# EasyEDA Pro project ProDoc_PCB3_2025-07-30.epro

# Board PCB3
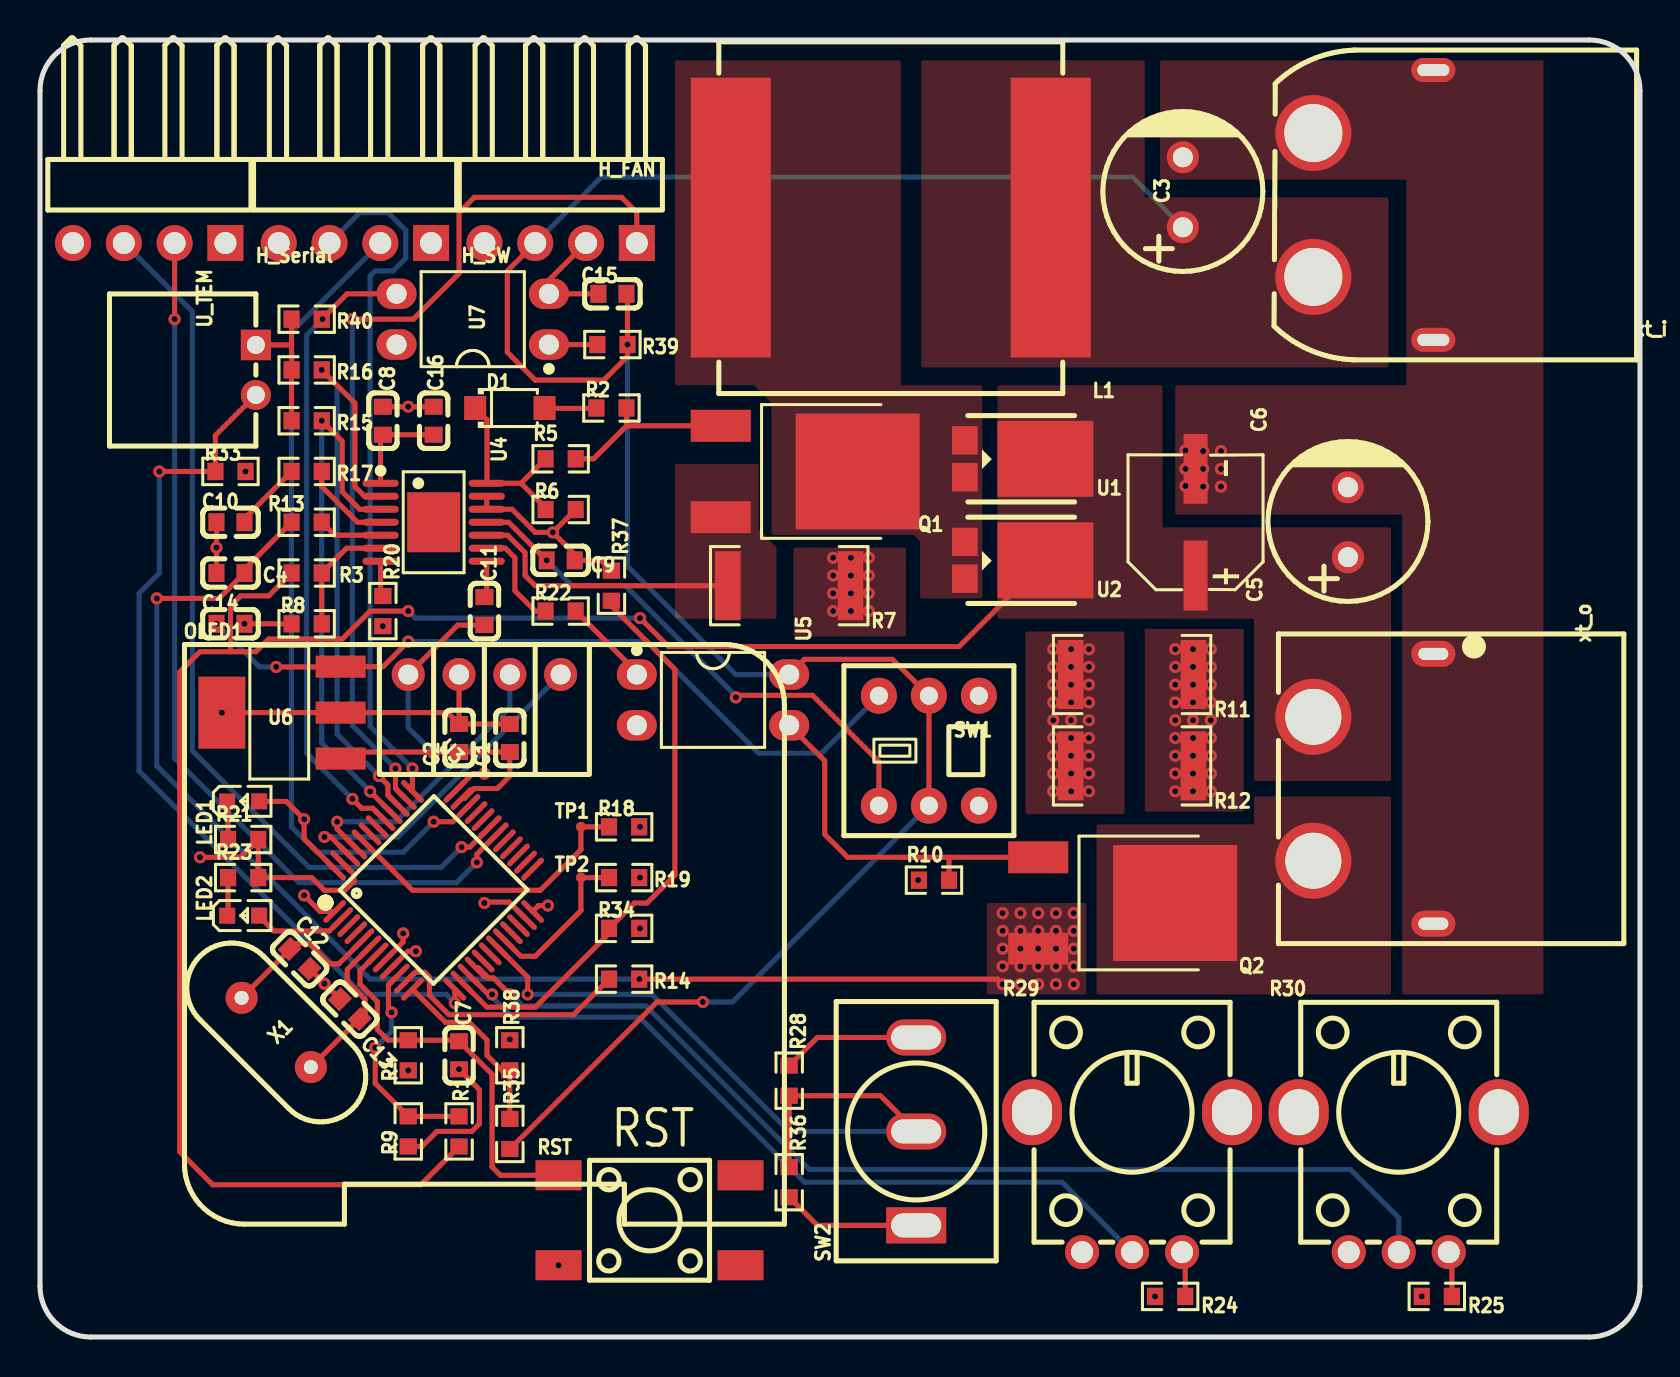
[diagram p0: board, top side]
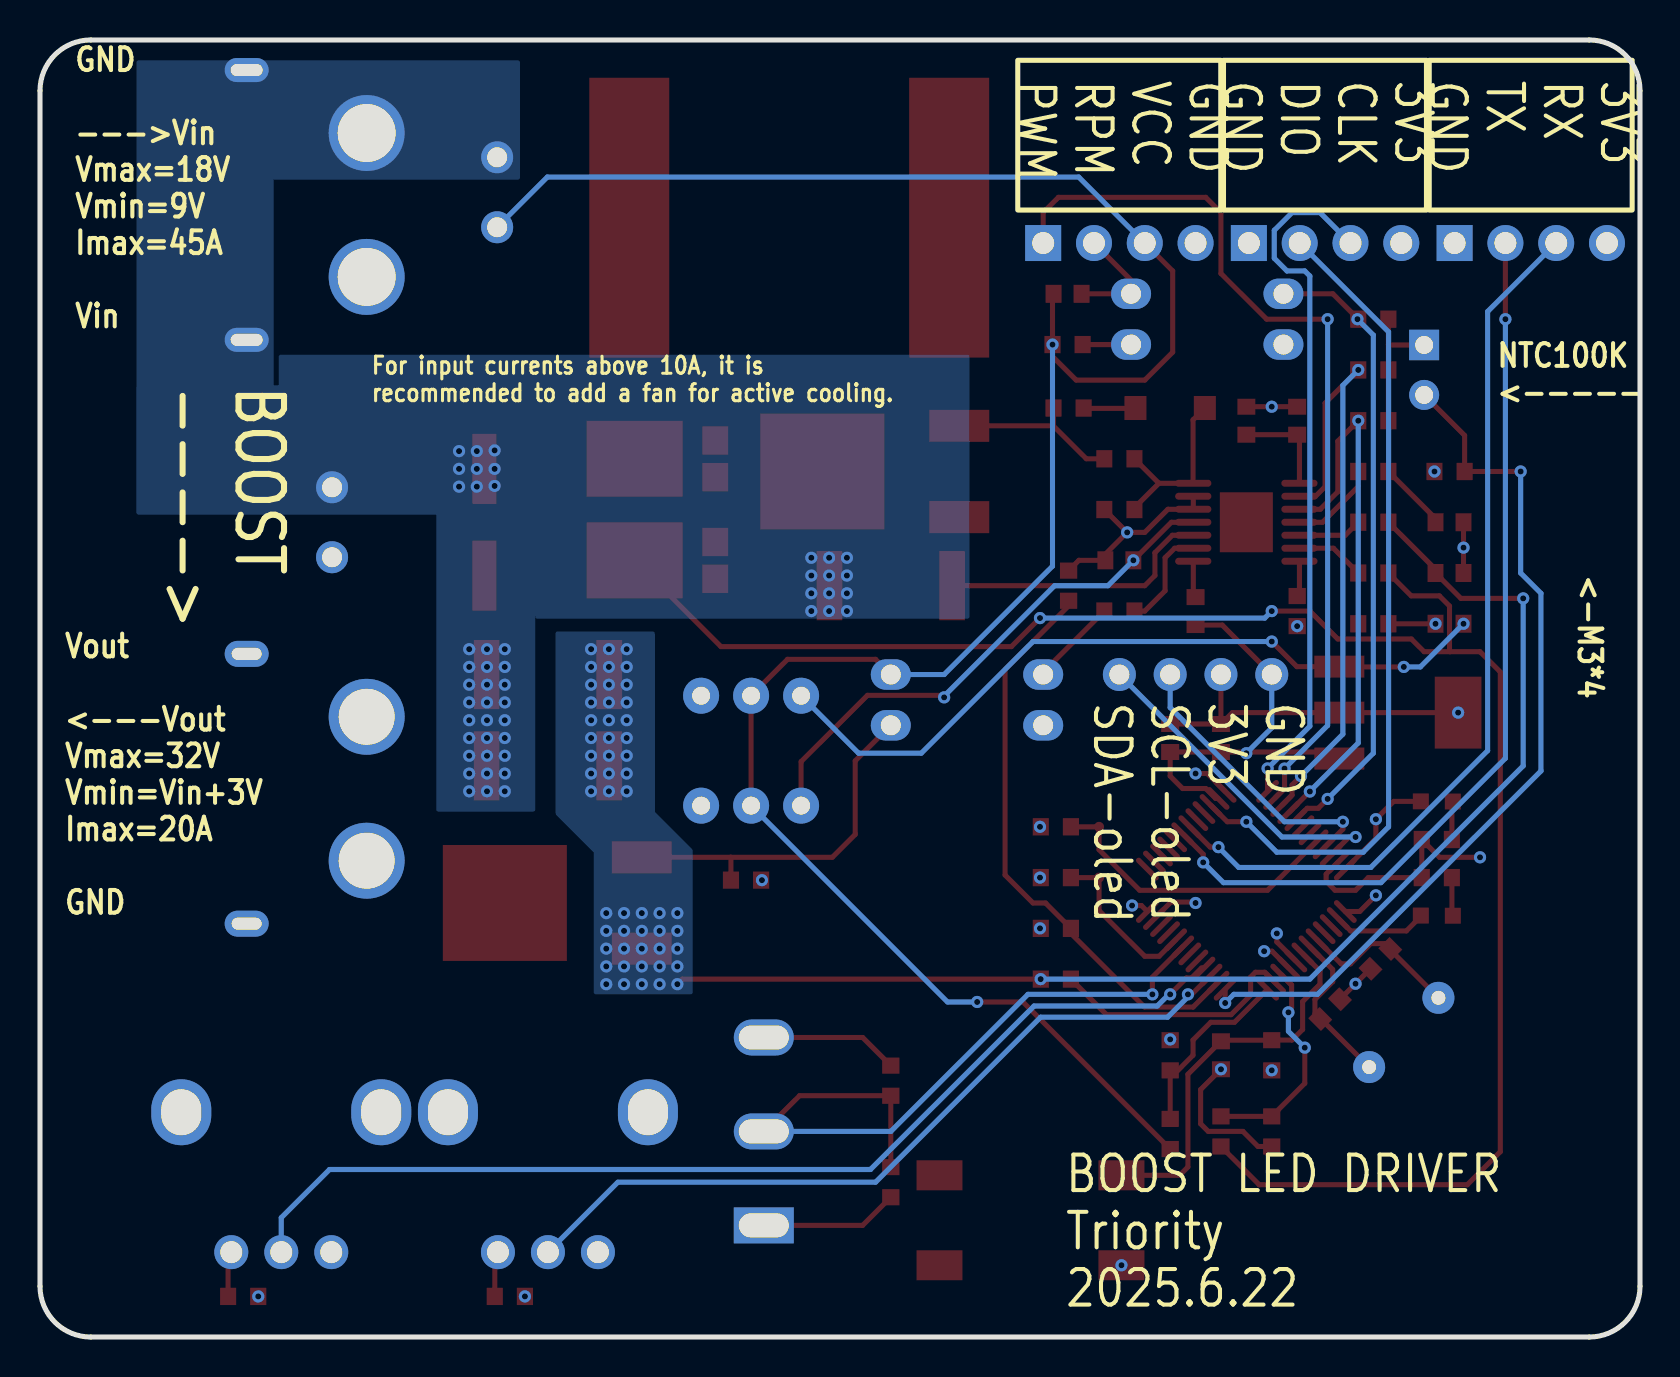
[diagram p1: board, bottom side, seen from below]

Outline 80.01 x 64.9 mm; copper layers: Top Layer, Inner1, Inner2, Bottom Layer. Coordinates in mm from the lower left corner of the outline.
Outline path: 0,62.36 0,2.54 arc(0.74,0.74) 2.54,0 77.47,0 arc(79.27,0.74) 80.01,2.54 80.01,62.36 arc(79.27,64.15) 77.47,64.9 2.54,64.9 arc(0.74,64.15) 0,62.36
Stack: Top Layer 0.035mm 外层铜厚1oz / Dielectric1 0.2104mm 7628 RC49% 8.6mil / Inner1 0.0152mm 内层铜厚 / Dielectric2 1.065mm 1.1mm H/HOZ Copper / Inner2 0.0152mm 内层铜厚 / Dielectric3 0.2104mm 7628 RC49% 8.6mil / Bottom Layer 0.035mm 外层铜厚1oz

## Design rules (mm)
template: 自定义配置
spacing copperThickness1oz (default): track to track 0.102, other pairs 0.152 to 0.3
spacing copperThickness2oz: track to track 0.203, other pairs 0.152 to 0.3
track width copperThickness1oz (default): min 0.127, default 0.254, max 2.54
track width copperThickness2oz: min 0.203, default 0.254, max 2.54
differential pair differentialPair (default): width min 0.127, default 0.254, max 2.54; gap min 0.152, default 0.152
via viaSize (default): diameter min 0.5, default 0.61, max 10; hole min 0.3, default 0.305, max 6.3
net GND uses copperRegion1
net $1N5540 uses copperRegion1
net $1N5178 uses copperRegion1
net $1N4854 uses copperRegion1
net CS uses copperRegion1
net $1N5417 uses copperRegion1
pour e84 uses copperRegion1
pour e1380 uses copperRegion
pour e1620 uses copperRegion
pour e759 uses copperRegion

## Placement (name value [footprint] x y rotation side)
C1  10uF  [C0603]  23.5 29.97 90 top
C2  100nF  [C0603]  20.96 29.97 90 top
C3  100uF  [CAP-TH_BD8.0-P3.50-D0.6-FD]  57.15 57.28 90 top
C4  100nF  [C0603]  9.53 38.23 180 top
C5  100uF  [CAP-TH_BD8.0-P3.50-D0.6-FD]  65.41 40.77 90 top
C6  22uF  [CAP-SMD_BD6.3-L6.6-W6.6-LS7.2-R-RD-1]  57.78 40.77 270 top
C7  100nF  [C0603]  20.96 14.1 270 top
C8  1uf/10nf?  [C0603]  17.14 45.85 270 top
C9  100nF  [C0603]  26.03 38.86 180 top
C10  1nF  [C0603]  9.53 40.77 0 top
C11  100nF  [C0603]  22.22 36.32 270 top
C12  20pF  [C0603]  12.98 18.92 315 top
C13  20pF  [C0603]  15.5 16.41 135 top
C14  10uF  [C0603]  9.53 35.69 0 top
C15  100nF  [C0603]  28.62 52.2 0 top
C16  1uf/10nf?  [C0603]  19.69 45.85 270 top
D1  1N4148W  [SOD-123_L2.7-W1.6-LS3.8-RD]  23.5 46.48 0 top
H_FAN  PZ254R-11-04P  [HDR-TH_4P-P2.54-H-M-W10.4]  26.03 54.74 180 top
H_Serial  PZ254R-11-04P  [HDR-TH_4P-P2.54-H-M-W10.4]  5.46 54.74 180 top
H_SW  PZ254R-11-04P  [HDR-TH_4P-P2.54-H-M-W10.4]  15.75 54.74 180 top
L1  3.3uH  [IND-SMD_L17.5-W17.2]  42.55 56.01 180 top
LED1  NCD0603R1  [LED0603-RD_RED]  10.16 26.8 0 top
LED2  NCD0603R1  [LED0603-RD_RED]  10.16 21.08 0 top
OLED1  -  [0.96OLED_4P]  22.22 33.15 0 top
Q1  NCE6080K  [TO-252-2_L6.6-W6.1-P4.57-LS10.1-BR-CW]  37.47 43.31 180 top
Q2  NCE6080K  [TO-252-2_L6.6-W6.1-P4.57-LS10.1-BR-CW]  53.34 21.72 180 top
R1  10k  [R0603]  20.96 10.29 270 top
R2  4.7Ω  [R0603]  28.57 46.48 0 top
R3  47k  [R0603]  13.34 38.23 180 top
R4  10kΩ  [R0603]  18.41 14.1 90 top
R5  4.7Ω  [R0603]  26.03 43.94 0 top
R6  10K  [R0603]  26.03 41.4 0 top
R7  1mΩ  [R2512]  37.47 37.59 180 top
R8  1k  [R0603]  13.34 35.69 0 top
R9  1k  [R0603]  18.41 10.29 90 top
R10  1k  [R0603]  44.7 22.86 0 top
R11  25mΩ  [R2512]  54.61 33.15 180 top
R12  25mΩ  [R2512]  54.61 28.58 180 top
R13  1k  [R0603]  13.34 40.77 0 top
R14  1k  [R0603]  29.21 17.91 180 top
R15  10K  [R0603]  13.34 45.85 180 top
R16  10K  [R0603]  13.34 48.39 180 top
R17  10K  [R0603]  13.34 43.31 180 top
R18  10kΩ  [R0603]  29.21 25.53 0 top
R19  10kΩ  [R0603]  29.21 22.99 180 top
R20  33K  [R0603]  17.14 36.32 270 top
R21  1kΩ  [R0603]  10.16 24.89 0 top
R22  100Ω  [R0603]  26.03 36.32 0 top
R23  1kΩ  [R0603]  10.16 22.99 0 top
R24  10k  [R0603]  56.52 2.03 180 top
R25  10k  [R0603]  69.85 2.03 180 top
R28  1k  [R0603]  37.47 12.83 270 top
R29  10kΩ  [RES-TH_RK09K1130A70]  54.61 7.75 0 top
R30  10kΩ  [RES-TH_RK09K1130A70]  67.94 7.75 0 top
R33  10k  [R0603]  9.53 43.31 0 top
R34  10k  [R0603]  29.21 20.45 0 top
R35  10k  [R0603]  23.5 10.16 270 top
R36  1k  [R0603]  37.47 7.75 270 top
R37  TCTR0603F100KF4310T  [R0603]  28.57 37.59 270 top
R38  1k  [R0603]  23.5 14.1 270 top
R39  100Ω  [R0603]  28.62 49.66 180 top
R40  1K  [R0603]  13.34 50.93 180 top
RST  TS-1002S-07526C  [SW-SMD_4P-L6.0-W6.0-P4.50-LS9.0-2]  30.48 5.84 0 top
SW1  SP-2214  [SW-TH_6P-L8.5-W8.5-P2.54_SP-2214]  44.45 29.34 180 top
SW2  MT-0-103-A101-M200-RS  [SW-TH_MT-0-103-A101-M200-RS]  43.81 10.29 90 top
TP1  -  [Test-Point-0.5mm]  27.05 25.53 0 top
TP2  -  [Test-Point-0.5mm]  27.05 22.99 0 top
U1  ST2045  [TO-277_3P-L5.4-W4.0-LS6.5-BR]  48.26 43.94 180 top
U2  ST2045  [TO-277_3P-L5.4-W4.0-LS6.5-BR]  48.26 38.86 180 top
U3  STM32F103C8T6  [LQFP-48_L7.0-W7.0-P0.50-LS9.0-BL]  19.69 22.35 315 top
U4  FP7209mR-G1  [TSSOP-14_L5.0-W4.4-P0.65-LS6.4-BL-EP]  19.69 40.77 270 top
U5  PC817C  [DIP-4_L4.6-W6.5-P2.54-LS7.6-BL]  33.66 31.88 270 top
U6  AMS1117-3.3  [SOT-223-3_L6.5-W3.4-P2.30-LS7.0-BR]  12.06 31.24 0 top
U7  PC817C  [DIP-4_L4.6-W6.5-P2.54-LS7.6-BL]  21.64 50.93 90 top
U_TEM  ZX-XH2.54-2PWZ  [CONN-TH_2P-P2.50_ZX-XH2.54-2PWZ]  10.8 48.39 270 top
X1  8MHz  [OSC-TH_L10.0-W4.5-P5.00]  11.81 15.24 45 top
xt_i  XT60PW-M  [CONN-TH_XT60PW-M]  66.68 56.64 180 top
xt_o  XT60PW-F  [TH_2P-XT60PW-F]  66.68 27.43 270 top

## Footprints (pads in the part's own frame, mm; a bottom-side part is the same pattern mirrored in y, then rotated)
0.96OLED_4P
  round 1.65 hole 1: 1(-3.81,-0.002) 2(-1.27,0.002) 3(1.27,0.002) 4(3.81,0.002)
C0603
  rect 0.8x0.9 smd: 1(-0.7,0) 2(0.7,0)
CAP-SMD_BD6.3-L6.6-W6.6-LS7.2-R-RD-1
  rect 3.5x1.2 smd: 1(2.67,0) 2(-2.67,0)
CAP-TH_BD8.0-P3.50-D0.6-FD
  round 1.6 hole 1: 1(-1.75,0) 2(1.75,0)
CONN-TH_2P-P2.50_ZX-XH2.54-2PWZ
  rect 1.524x1.5 hole 0.9: 1(-1.25,0)
  round 1.5 hole 0.9: 2(1.25,0)
CONN-TH_XT60PW-M
  round 3.8 hole 2.9: 1(3,-3.6) 2(3,3.6)
  oval 2.2x1.2 hole 1.6x0.6: 3(-3,6.75) 4(-3,-6.75)
DIP-4_L4.6-W6.5-P2.54-LS7.6-BL
  oval 1.524x2 hole 1: 1(-1.27,-3.81) 2(1.27,-3.81) 3(1.27,3.81) 4(-1.27,3.81)
HDR-TH_4P-P2.54-H-M-W10.4
  rect 1.8x1.8 hole 1.1: 1(-3.81,0)
  round 1.8 hole 1.1: 2(-1.27,0) 3(1.27,0) 4(3.81,0)
IND-SMD_L17.5-W17.2
  rect 4x14 smd: 1(-8,0) 2(8,0)
LED0603-RD_RED
  rect 0.8x0.8 smd: 1(-0.799,-0.004) 2(0.799,0.004)
LQFP-48_L7.0-W7.0-P0.50-LS9.0-BL
  oval 0.27x1.5 smd: 1(-2.75,-4.25) 2(-2.25,-4.25) 3(-1.75,-4.25) 4(-1.25,-4.25) 5(-0.75,-4.25) 6(-0.25,-4.25) 7(0.25,-4.25) 8(0.75,-4.25) 9(1.25,-4.25) 10(1.75,-4.25) 11(2.25,-4.25) 12(2.75,-4.25) 25(2.75,4.25) 26(2.25,4.25) 27(1.75,4.25) 28(1.25,4.25) 29(0.75,4.25) 30(0.25,4.25) 31(-0.25,4.25) 32(-0.75,4.25) 33(-1.25,4.25) 34(-1.75,4.25) 35(-2.25,4.25) 36(-2.75,4.25)
  oval 1.5x0.27 smd: 13(4.25,-2.75) 14(4.25,-2.25) 15(4.25,-1.75) 16(4.25,-1.25) 17(4.25,-0.75) 18(4.25,-0.25) 19(4.25,0.25) 20(4.25,0.75) 21(4.25,1.25) 22(4.25,1.75) 23(4.25,2.25) 24(4.25,2.75) 37(-4.25,2.75) 38(-4.25,2.25) 39(-4.25,1.75) 40(-4.25,1.25) 41(-4.25,0.75) 42(-4.25,0.25) 43(-4.25,-0.25) 44(-4.25,-0.75) 45(-4.25,-1.25) 46(-4.25,-1.75) 47(-4.25,-2.25) 48(-4.25,-2.75)
OSC-TH_L10.0-W4.5-P5.00
  round 1.6 hole 0.7: 1(0,2.45) 2(0,-2.45)
R0603
  rect 0.806x0.864 smd: 1(-0.753,0) 2(0.753,0)
R2512
  rect 1.282x3.456 smd: 1(-3.067,0) 2(3.067,0)
RES-TH_RK09K1130A70
  round 1.7 hole 1.1: 1(-2.5,-3.5) 2(0,-3.5) 3(2.5,-3.5)
  oval 3x3.3 hole 2x2.3: 4(5,3.5) 5(-5,3.5)
SOD-123_L2.7-W1.6-LS3.8-RD
  rect 1.1x1.2 smd: 1(-1.735,0) 2(1.735,0)
SOT-223-3_L6.5-W3.4-P2.30-LS7.0-BR
  rect 2.5x1.1 smd: 1(2.97,-2.3) 2(2.97,0) 3(2.97,2.3)
  rect 2.34x3.6 smd: 4(-2.97,0)
SW-SMD_4P-L6.0-W6.0-P4.50-LS9.0-2
  rect 2.3x1.5 smd: 1(-4.55,2.25) 2(4.55,2.25) 3(-4.55,-2.25) 4(4.55,-2.25)
SW-TH_6P-L8.5-W8.5-P2.54_SP-2214
  round 1.8 hole 0.9: 1(-2.5,-2.75) 2(0,-2.75) 3(2.5,-2.75) 4(-2.5,2.75) 5(0,2.75) 6(2.5,2.75)
SW-TH_MT-0-103-A101-M200-RS
  rect 1.8x3 hole 1.2x2.5: 1(-4.7,0)
  oval 1.8x3 hole 1.2x2.5: 2(0,0) 3(4.7,0)
Test-Point-0.5mm
  round 0.5 smd: 1(0,0)
TH_2P-XT60PW-F
  oval 1.3x2.2 hole 0.6x1.5: 1(-6.75,3) 2(6.75,3)
  round 3.8 hole 2.8: 3(-3.6,-3) 4(3.6,-3)
TO-252-2_L6.6-W6.1-P4.57-LS10.1-BR-CW
  rect 3x1.6 smd: 1(3.423,-2.285) 3(3.424,2.285)
  rect 6.2x5.8 smd: 2(-3.424,0)
TO-277_3P-L5.4-W4.0-LS6.5-BR
  rect 1.29x1.423 smd: 1(2.017,-0.92) 3(2.017,0.92)
  rect 4.8x3.8 smd: 2(-2.017,0)
TSSOP-14_L5.0-W4.4-P0.65-LS6.4-BL-EP
  oval 0.35x1.809 smd: 1(-1.95,-2.655) 2(-1.3,-2.655) 3(-0.65,-2.655) 4(0,-2.655) 5(0.65,-2.655) 6(1.3,-2.655) 7(1.95,-2.655) 8(1.95,2.655) 9(1.3,2.655) 10(0.65,2.655) 11(0,2.655) 12(-0.65,2.655) 13(-1.3,2.655) 14(-1.95,2.655)
  rect 3x2.65 smd: 15(0,0)

## Nets
3V3: C1.2 C2.2 H_Serial.4 H_SW.4 LED1.2 OLED1.2 R4.1 R24.2 R25.2 R28.1 R33.2 R34.2 SW2.3 U3.1 U3.9 U3.24 U3.36 U3.48 U6.2 U6.4 U7.4
GND: C1.1 C2.1 C3.2 C4.2 C5.2 C6.2 C7.2 C8.1 C9.1 C10.1 C11.2 C12.2 C13.2 C14.2 C16.1 H_FAN.4 H_Serial.1 H_SW.1 OLED1.1 R6.2 R7.1 R8.1 R9.1 R10.1 R11.1 R12.1 R15.2 R16.2 R18.2 R19.1 R20.2 R21.2 R23.2 R29.1 R29.4 R29.5 R30.1 R30.4 R30.5 R36.2 R37.1 R38.1 R40.2 RST.3 SW2.1 U3.8 U3.23 U3.35 U3.47 U4.12 U4.13 U4.15 U5.2 U6.1 U_TEM.1 xt_i.1 xt_i.3 xt_i.4 xt_o.1 xt_o.2
VCC: C3.1 C15.2 H_FAN.3 L1.1 R35.2 R39.1 SW1.2 SW1.5 U5.4 xt_i.2
7209DIM: R16.1 U3.39 U4.2
7209EN: R15.1 U3.40 U4.3
BOOT0: R18.1 TP1.1 U3.44
CS: Q1.3 R7.2 U4.10
EXT: D1.1 R5.1 R6.1 U4.14
FB1: R13.2 U4.5
FB2: R14.2 U3.11
KNOB0: R29.2 U3.15
KNOB1: R30.2 U3.16
OLED_SCL: OLED1.3 U3.45
OLED_SDA: OLED1.4 U3.46
OSC_IN: C12.1 U3.5 X1.1
OSC_OUT: C13.1 U3.6 X1.2
OVP: R3.1 R8.2 U4.6
PA0-WKUP: R1.1 R9.2 U3.10
PA2: R35.1 R38.2 U3.12
PA3: R33.1 U3.13 U_TEM.2
PA4: R34.1 R37.2 U3.14
PA7: U3.17
PA8: U3.29
PA9/USART1_TX: H_Serial.2 U3.30
PA10/USART1_RX: H_Serial.3 U3.31
PA11: U3.32
PA12: U3.33
PA13/SWDIO: H_SW.2 U3.34
PA14/SWCLK: H_SW.3 U3.37
PA15: H_FAN.1 U3.38
PB0: U3.18
PB1: R28.2 R36.1 SW2.2 U3.19
PB2/BOOT1: R19.2 TP2.1 U3.20
PB5: R40.1 U3.41 U7.3
PB6: U3.42
PB7: U3.43
PB10: U3.21
PB11: U3.22
PB12: U3.25
PB13: U3.26
PB14: U3.27
PB15: U3.28
PC13: LED2.2 U3.2
SC: Q2.1 R10.2 U5.3
SCC: R22.1 U4.9
VFP: C9.2 SW1.6 U4.11
VLDO: C14.1 SW1.3 U6.3
$1N1367: C7.1 R4.2 RST.1 U3.7
$1N2210: LED2.1 R23.1
$1N2212: LED1.1 R21.1
$1N2533: R24.1 R29.3
$1N2538: R25.1 R30.3
$1N3069: C15.1 H_FAN.2 U7.2
$1N4854: L1.2 Q1.2 U1.1 U1.3 U2.1 U2.3
$1N5178: C5.1 C6.1 R1.2 R3.2 U1.2 U2.2 xt_o.3
$1N5417: Q2.2 xt_o.4
$1N5540: C4.1 Q2.3 R11.2 R12.2 R13.1 R14.1
$1N7422: R20.1 U4.7
$1N7522: Q1.1 R2.2 R5.2
$1N7915: C11.1 U4.8
$1N7961: R17.1 U4.4
$1N7987: C10.2 R17.2
$1N8074: C8.2 C16.2 U4.1
$1N8778: R39.2 U7.1
$1N23500: R22.2 U5.1
$1N23693: D1.2 R2.1

Pads without a net: RST 2 4; SW1 1 4; U3 3 4

## Via types
v1: diameter 0.61, hole 0.305, Top Layer to Bottom Layer, 160 vias

## Routing (per net, layer and track width the routed paths; a pad name or vN(x,y) marks a point on that pad's centre or on a via; arc(x,y) is an arc through that point)
3V3: length 36
  Top Layer w0.254: v1(22.22,28.19) 21.64,28.19 U3.36 ; C2.2 20.38,31.24 U6.2 v1(9.09,31.24) ; C2.2 C1.2 ; C2.2 OLED1.2 ; U3.48 13.21,24.94 v1(13.21,25.91) 12.32,26.8 LED1.2 ; SW2.3 38.87,14.99 R28.1 ; v1(25.4,21.59) 24.93,21.59 U3.24 ; v1(13.21,22.1) 14.01,21.29 U3.1 ; v1(18.8,19.3) 18.4,19.3 U3.9
  vias: v1(10.28,43.31) v1(18.41,13.34) v1(30,20.45) v1(55.76,2.03) v1(69.1,2.03)
GND: length 78.3
  Top Layer w0.254: 13.48,18.43 v1(14.23,17.68) 15,16.9 ; U3.47 15.7,23.16 15.7,22.8 15.25,22.35 14.22,22.35 13.59,22.99 R23.2 R21.2 10.02,24 v1(8,24) ; U6.1 15.37,29.27 C2.1 C1.1 23.5,28.07 22.87,27.44 21.72,27.44 21.22,26.95 21.1,26.95 ; v1(10.23,35.69) R8.1 ; v1(22.22,21.72) 22.27,21.76 23.46,21.76 24.28,20.94 ; OLED1.1 20.89,35.62 C11.2 ; U4.13 U4.12 23.61,41.42 24.77,40.26 v1(25.65,40.26) ; R40.2 12.58,49.66 ; 12.58,49.66 12.56,49.64 U_TEM.1 ; 12.58,49.66 R16.2 R15.2 ; C16.1 v1(18.42,46.55) C8.1 ; v1(25.65,40.26) 26.74,39.17 C9.1 28.06,38.86 R37.1 ; v1(25.65,40.26) R6.2 ; v1(18.16,20.19) 18.16,19.77 17.21,18.82 ; R36.2 38.87,5.59 SW2.1 ; v1(20.96,13.4) 21.97,12.38 21.97,10.67 21.59,10.29 19.85,10.29 19.1,9.53 R9.1 ; C10.1 v1(8.83,39.5) C4.2
  Bottom Layer w0.254: OLED1.1 18.41,30.48 v1(19.69,29.21)
  vias: v1(17.14,35.57) v1(23.5,14.89) v1(25.93,3.59) v1(30,25.53) v1(30,22.99) v1(39.66,38.99) v1(39.66,38.1) v1(39.66,37.21) v1(39.66,36.32) v1(40.55,38.99) v1(40.55,38.1) v1(40.55,37.21) v1(40.55,36.32) v1(41.44,38.99) v1(41.44,38.1) v1(41.44,37.21) v1(41.44,36.32) v1(43.91,22.86) v1(56.77,34.42) v1(56.77,33.53) v1(56.77,32.64) v1(56.77,31.75) v1(56.77,30.86) v1(56.77,29.97) v1(56.77,29.08) v1(56.77,28.19) v1(56.77,27.3) v1(57.28,44.36) v1(57.28,43.44) v1(57.28,42.58) v1(57.66,34.42) v1(57.66,33.53) v1(57.66,32.64) v1(57.66,31.75) v1(57.66,30.86) v1(57.66,29.97) v1(57.66,29.08) v1(57.66,28.19) v1(57.66,27.3) v1(58.17,44.33) v1(58.17,43.44) v1(58.17,42.55) v1(58.55,34.42) v1(58.55,33.53) v1(58.55,32.64) v1(58.55,31.75) v1(58.55,30.86) v1(58.55,29.97) v1(58.55,29.08) v1(58.55,28.19) v1(58.55,27.3) v1(59.06,44.33) v1(59.06,43.44) v1(59.06,42.55)
VCC: length 114.1
  Top Layer w0.254: C15.2 29.38,52.14 v1(29.38,49.66) 29.38,49.06 28.19,47.88 24.77,47.88 23.37,49.28 23.37,53.34 H_FAN.3 ; U5.4 38.23,33.91 42.63,33.91 SW1.2 SW1.5 ; v1(33.15,16.76) 30.85,16.76 R35.2
  Bottom Layer w0.254: H_FAN.3 28.07,58.04 54.64,58.04 C3.1 ; v1(29.38,49.66) 29.38,38.57 34.8,33.15 U5.4 ; SW1.5 34.63,16.76 v1(33.15,16.76)
7209DIM: length 31.4
  Top Layer w0.254: U4.2 16.23,42.07 15.75,42.55 15.75,46.73 v1(14.09,48.39) ; U3.39 17.4,27.11 17.4,27.62 v1(16.95,28.07)
  Bottom Layer w0.254: v1(16.95,28.07) 14.86,30.16 14.86,47.62 v1(14.09,48.39)
7209EN: length 27.3
  Top Layer w0.254: v1(14.09,45.85) 15.11,44.82 15.11,42.29 15.99,41.42 U4.3 ; U3.40 v1(16.51,27.29)
  Bottom Layer w0.254: v1(16.51,27.29) 16.51,27.3 14.09,29.72 v1(14.09,45.85)
BOOT0: length 15.3
  Top Layer w0.254: R18.1 TP1.1 27.05,24.38 25.02,22.35 18.62,22.35 U3.44
CS: length 13.8
  Top Layer w0.254: R7.2 24.77,37.59 24.26,38.1 24.26,39.24 23.38,40.12 U4.10
EXT: length 9.3
  Top Layer w0.254: 24.06,42.72 R5.1 ; 24.06,42.72 U4.14 22.35,42.73 22.35,45.89 D1.1 ; 24.06,42.72 25.28,41.49 R6.1
FB1: length 3.2
  Top Layer w0.254: R13.2 14.74,40.12 U4.5
FB2: length 12.5
  Top Layer w0.254: R14.2 26.68,16.13 20.45,16.13 19.47,17.1 19.47,18.01 19.23,18.25 18.77,18.25 U3.11
KNOB0: length 39
  Top Layer w0.254: v1(22.61,17.14) 22.42,17.14 U3.15
  Bottom Layer w0.254: v1(22.61,17.14) 22.61,17.02 23.62,16 29.97,16 38.23,7.75 51.11,7.75 R29.2
KNOB1: length 53
  Top Layer w0.254: v1(23.5,17.14) 22.67,17.97 22.42,17.97 21.93,18.46 U3.16
  Bottom Layer w0.254: R30.2 67.94,5.97 65.53,8.38 38.48,8.38 30.3,16.56 24.14,16.56 23.56,17.14 v1(23.5,17.14)
OLED_SCL: length 14.4
  Top Layer w0.254: 15.8,24.47 14.86,25.41 v1(14.86,25.78)
  Bottom Layer w0.254: v1(14.86,25.78) 17.78,25.78 23.5,31.5 OLED1.3
OLED_SDA: length 16.8
  Top Layer w0.254: v1(14.22,25.02) 14.54,25.02 U3.46
  Bottom Layer w0.254: OLED1.4 17.91,25.02 v1(14.22,25.02)
OSC_IN: length 8.1
  Top Layer w0.254: X1.1 12.49,19.38 12.49,19.42 12.75,19.69 13.46,19.69 14.48,18.67 14.94,18.67 U3.5
OSC_OUT: length 8
  Top Layer w0.254: X1.2 15.95,15.91 15.99,15.91 16.26,16.18 16.26,16.89 15.37,17.78 15.37,18.39 U3.6
OVP: length 6
  Top Layer w0.254: U4.6 15.33,39.47 R3.1 R8.2
PA0-WKUP: length 10.9
  Top Layer w0.254: v1(16.76,14.48) 16.76,12.69 R9.2 R1.1 ; U3.10 17.91,18.11 17.42,17.62 17.42,16.49 17.58,16.33 v1(17.58,16.24)
  Bottom Layer w0.254: v1(17.58,16.24) 17.58,15.3 v1(16.76,14.48)
PA2: length 9.4
  Top Layer w0.254: R35.1 R38.2 23.11,13.34 22.35,14.1 22.35,14.86 21.46,15.75 20.28,15.75 U3.12
PA3: length 44.2
  Top Layer w0.254: U3.13 v1(20.75,16.71) ; v1(5.97,43.31) R33.1 8.77,45.11 U_TEM.2
  Bottom Layer w0.254: v1(20.75,16.71) 20.31,17.14 16.13,17.14 4.95,28.32 4.95,37.21 5.97,38.23 v1(5.97,43.31)
PA4: length 29.1
  Top Layer w0.254: R37.2 28.57,36.58 31.75,33.4 31.75,23.11 30.35,21.72 29.73,21.72 R34.1 28.46,20.19 24.77,16.51 22.34,16.51 U3.14
PA9/USART1_TX: length 45.7
  Top Layer w0.254: U3.30 21.84,24.16 v1(21.84,23.75) ; v1(6.73,50.93) H_Serial.2
  Bottom Layer w0.254: v1(21.84,23.75) 20.83,22.73 12.95,22.73 6.73,28.96 v1(6.73,50.93)
PA10/USART1_RX: length 45
  Top Layer w0.254: v1(21.08,24.51) 21.49,24.51 22.51,25.53
  Bottom Layer w0.254: H_Serial.3 7.62,51.31 7.62,29.34 13.46,23.49 20.07,23.49 v1(21.08,24.51)
PA13/SWDIO: length 41.4
  Top Layer w0.254: v1(19.69,25.78) 20.64,25.78 U3.34
  Bottom Layer w0.254: v1(19.69,25.78) 18.16,24.26 13.84,24.26 12.57,25.53 12.57,50.29 H_SW.2
PA14/SWCLK: length 35
  Top Layer w0.254: U3.37 v1(18.62,28.45)
  Bottom Layer w0.254: H_SW.3 16,56.26 17.4,56.26 18.29,55.37 18.29,53.97 17.65,53.34 16.76,53.34 16.51,53.09 16.51,30.56 v1(18.62,28.45)
PA15: length 45.5
  Top Layer w0.254: 18.27,26.95 17.78,27.44 v1(17.78,28.44) ; H_FAN.1 29.84,56.26 29.08,57.02 21.72,57.02 20.96,56.26 20.96,53.21 18.67,50.93 v1(15.62,50.93)
  Bottom Layer w0.254: v1(15.62,50.93) 15.62,30.6 v1(17.78,28.44)
PB1: length 35.9
  Top Layer w0.254: R36.1 R28.2 42.03,12.07 SW2.2 ; U3.19 24.38,18.01 v1(24.38,17.14)
  Bottom Layer w0.254: v1(24.38,17.14) 30.61,17.14 37.47,10.29 SW2.2
PB2/BOOT1: length 8.2
  Top Layer w0.254: U3.20 24.05,19.05 24.77,19.05 27.05,21.34 TP2.1 R19.2
PB5: length 31.6
  Top Layer w0.254: U7.3 15.36,52.2 R40.1 ; v1(15.62,26.92) 16.09,26.46 16.64,26.46 17.21,25.89
  Bottom Layer w0.254: v1(15.62,26.92) 13.34,29.21 13.34,50.13 v1(14.13,50.93)
PC13: length 4.7
  Top Layer w0.254: 15.09,20.94 14.47,20.32 11.68,20.32 10.96,21.04 LED2.2
SC: length 18.5
  Top Layer w0.254: 45.47,24 40.39,24 39.24,25.15 39.24,28.83 U5.3 ; 45.47,24 Q2.1 ; 45.47,24 45.46,23.99 R10.2
SCC: length 5.2
  Top Layer w0.254: U4.9 23.27,39.47 23.75,38.99 23.75,37.34 24.77,36.32 R22.1
VFP: length 26.9
  Top Layer w0.254: v1(34.8,32) 34.9,32.11 38.63,32.11 41.95,28.79 SW1.6 ; U4.11 23.43,40.77 v1(25.34,38.86)
  Bottom Layer w0.254: v1(34.8,32) 34.8,32.07 29.27,37.59 26.6,37.59 v1(25.34,38.86)
VLDO: length 38.1
  Top Layer w0.254: v1(11.81,33.53) 15.02,33.53 15.03,33.54 17.16,33.54 v1(18.41,34.8)
  Bottom Layer w0.254: v1(8.83,35.69) 10.98,33.53 v1(11.81,33.53) ; v1(18.41,34.8) 30.35,34.8 35.94,29.21 39.07,29.21 SW1.3
$1N1367: length 19.3
  Top Layer w0.254: RST.1 23.02,8.09 22.61,8.51 22.61,13.15 C7.1 20.9,14.85 R4.2 18.41,14.86 17.4,14.86 16.87,15.39 16.87,16.78 16,17.65 16,18.32 U3.7
$1N2210: length 1.9
  Top Layer w0.254: R23.1 9.41,21.12 LED2.1
$1N2212: length 1.9
  Top Layer w0.254: R21.1 9.41,26.75 LED1.1
$1N2533: length 2.3
  Top Layer w0.254: R29.3 57.27,4.09 R24.1
$1N2538: length 2.3
  Top Layer w0.254: R25.1 70.6,4.09 R30.3
$1N3069: length 5.8
  Top Layer w0.254: C15.1 25.45,52.2 25.45,52.88 H_FAN.2
$1N5178: length 92.6
  Top Layer w0.254: v1(30,35.97) 31.43,34.54 45.96,34.54 U2.2 ; R1.2 19.04,7.62 8.64,7.62 6.98,9.27 6.98,33.27 8,34.29 9.5,34.29 ; 9.5,34.29 9.53,34.32 9.53,36.58 10.03,37.08 11.44,37.08 R3.2 ; 9.5,34.29 10.8,34.29 11.43,34.92 15.11,34.92 16.51,36.32 v1(18.41,36.32)
  Bottom Layer w0.254: v1(18.41,36.32) 18.76,35.97 v1(30,35.97)
$1N5540: length 63.6
  Top Layer w0.254: v1(5.84,36.96) 8.95,36.96 C4.1 10.23,38.41 R13.1 ; v1(48.14,17.65) 47.88,17.91 v1(29.97,17.91)
  Bottom Layer w0.254: v1(5.84,36.96) 5.84,28.58 16.51,17.91 v1(29.97,17.91)
  vias: v1(48.14,21.21) v1(48.14,20.32) v1(48.14,19.43) v1(48.14,18.54) v1(49.03,21.21) v1(49.03,20.32) v1(49.03,19.43) v1(49.03,18.54) v1(49.03,17.65) v1(49.92,21.21) v1(49.92,20.32) v1(49.92,19.43) v1(49.92,18.54) v1(49.92,17.65) v1(50.67,34.42) v1(50.67,33.53) v1(50.67,32.64) v1(50.67,31.75) v1(50.67,30.86) v1(50.67,29.97) v1(50.67,29.08) v1(50.67,28.19) v1(50.67,27.3) v1(50.81,21.21) v1(50.81,20.32) v1(50.81,19.43) v1(50.81,18.54) v1(50.81,17.65) v1(51.56,34.42) v1(51.56,33.53) v1(51.56,32.64) v1(51.56,31.75) v1(51.56,30.86) v1(51.56,29.97) v1(51.56,29.08) v1(51.56,28.19) v1(51.56,27.3) v1(51.69,21.21) v1(51.69,20.32) v1(51.69,19.43) v1(51.69,18.54) v1(51.69,17.65) v1(52.45,34.42) v1(52.45,33.53) v1(52.45,32.64) v1(52.45,31.75) v1(52.45,30.86) v1(52.45,29.97) v1(52.45,29.08) v1(52.45,28.19) v1(52.45,27.3)
$1N7422: length 1.8
  Top Layer w0.254: R20.1 17.03,37.19 U4.7
$1N7522: length 8.8
  Top Layer w0.254: R2.2 29.33,45.6 29.34,45.59 ; Q1.1 29.34,45.59 ; 29.34,45.59 27.69,43.94 R5.2
$1N7915: length 1.8
  Top Layer w0.254: C11.1 22.34,37.14 U4.8
$1N7961: length 4.4
  Top Layer w0.254: U4.4 15.88,40.77 14.09,42.55 R17.1
$1N7987: length 3.5
  Top Layer w0.254: R17.2 10.23,40.95 C10.2
$1N8074: length 5
  Top Layer w0.254: C16.2 C8.2 17.03,45.03 U4.1
$1N8778: length 2.4
  Top Layer w0.254: 27.87,49.66 25.45,49.66
$1N23500: length 4.4
  Top Layer w0.254: U5.1 29.84,33.27 R22.2
$1N23693: length 2.6
  Top Layer w0.254: 25.23,46.48 25.25,46.46 27.8,46.46 R2.1

## Copper pours and planes (outline as drawn; the poured copper is in the pictures)
3V3 on Inner2: 0.39,58.92 31.12,58.92 31.12,34.6 33.66,32.07 33.66,22.95 39.81,16.79 75.18,16.79 75.18,1.52 4.66,1.52 4.66,48.04 0.38,52.32 0.38,58.91
GND on Top Layer: 43.31,35.05 43.31,39.5 37.68,39.5 37.68,35.09 37.72,35.05
GND on Top Layer: 56.01,63.88 75.18,63.88 75.18,17.14 68.11,17.14 68.11,41.15 56.77,41.15 56.77,47.62 68.33,47.62 68.33,57.91 56.01,57.91
GND on Top Layer: 55.25,35.43 60.2,35.43 60.2,26.29 55.29,26.29 55.25,26.33
GND on Bottom Layer: 68.33,57.91 68.33,41.15 75.18,41.15 75.18,63.88 56.01,63.88 56.01,57.93 56.03,57.91
GND on Bottom Layer: 55.25,26.29 60.2,26.29 60.2,41.15 75.18,41.15 75.18,47.62 55.25,47.62
GND on Bottom Layer: 33.53,35.94 55.25,35.94 55.25,41.15 68.07,41.15 68.07,49.15 33.53,49.15
GND on Inner1: 4.83,63.88 4.83,1.4 75.06,1.4 75.06,63.88
GND on Inner2: 75.18,17.53 75.18,63.88 74.93,64.13 32,64.13 31.75,63.88 31.75,35.43 34.29,32.89 34.29,23.11 39.88,17.53
VCC on Top Layer: 55.25,57.02 67.44,57.02 67.44,48.51 44.07,48.51 44.07,63.88 55.25,63.88
CS on Top Layer: 35.94,43.69 35.94,40.39 36.83,39.5 36.83,35.94 31.75,35.94 31.75,43.69
$1N4854 on Top Layer: 47.12,36.96 47.12,47.62 43.05,47.62 43.05,63.88 31.75,63.88 31.75,47.62 35.69,47.62 36.58,46.74 36.58,40.13 43.69,40.13 44.01,39.81 44.01,36.96
$1N5178 on Top Layer: 47.88,47.62 56.13,47.62 56.13,40.51 67.56,40.51 67.56,27.81 60.71,27.81 60.71,35.94 47.88,35.94
$1N5417 on Top Layer: 52.83,25.65 60.71,25.65 60.71,27.05 67.56,27.05 67.56,17.14 52.83,17.14
$1N5540 on Top Layer: 52.32,21.72 52.32,17.14 47.35,17.14 47.35,21.72
$1N5540 on Top Layer: 49.28,35.31 54.23,35.31 54.23,26.16 49.32,26.16 49.28,26.2
$1N5540 on Bottom Layer: 47.37,17.14 52.32,17.14 52.32,24.26 54.23,26.16 54.23,35.31 49.26,35.31 49.26,26.27 47.37,24.38

## Text on the board
Bottom Silkscreen Layer: For input currents above 10A, it is / recommended to add a fan for active cooling. | GND / --->Vin / Vmax=18V / Vmin=9V / Imax=45A / Vin | Vout / <---Vout / Vmax=32V / Vmin=Vin+3V / Imax=20A / GND | NTC100K / <----- | <-M3*4 | 3V3 / RX / TX / GND | 3V3 / CLK / DIO / GND | GND / VCC / RPM / PWM | GND / 3V3 / SCL-oled / SDA-oled | BOOST LED DRIVER / Triority / 2025.6.22 | BOOST / ---->
Top Silkscreen Layer: RST
